# Altium schematic sheet Fuse_Block.SchDoc: <Document>
size Letter; Engineer: <Engineer>; Organization: UPEL; Address1: USU Power Electronics Lab; Address2: USTAR Building 620, RM 118; Address3: 1600 N 620 E; Address4: North Logan, UT 84341; DocumentNumber: 6; Revision: v1; SheetNumber: 6; SheetTotal: 16; ProjectName: <Project>
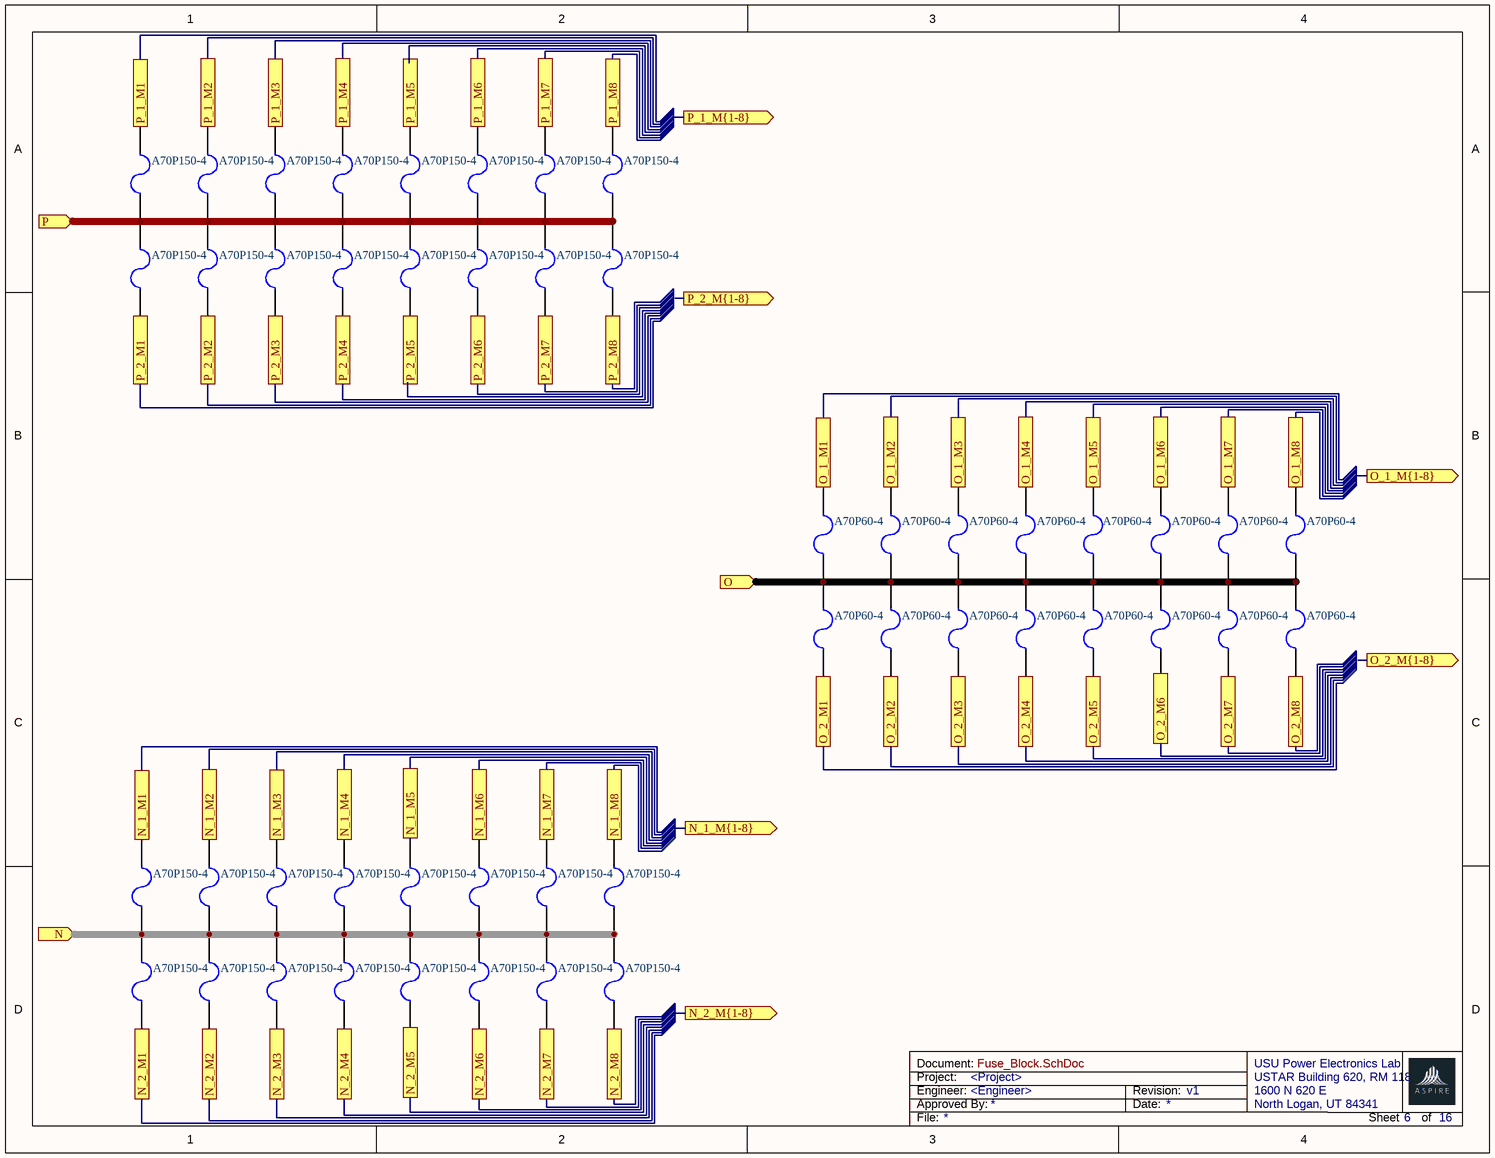
[diagram p0: Fuse_Block.SchDoc]

## Parts
F6  A70P150-4  [1206]
F17  A70P150-4  [1206]
F18  A70P150-4  [1206]
F19  A70P150-4  [1206]
F20  A70P150-4  [1206]
F21  A70P150-4  [1206]
F22  A70P150-4  [1206]
F23  A70P150-4  [1206]
F24  A70P150-4  [1206]
F25  A70P150-4  [1206]
F26  A70P150-4  [1206]
F27  A70P150-4  [1206]
F28  A70P150-4  [1206]
F29  A70P150-4  [1206]
F30  A70P150-4  [1206]
F31  A70P150-4  [1206]
F32  A70P60-4  [1206]
F33  A70P60-4  [1206]
F34  A70P60-4  [1206]
F35  A70P60-4  [1206]
F36  A70P60-4  [1206]
F37  A70P60-4  [1206]
F38  A70P60-4  [1206]
F39  A70P60-4  [1206]
F40  A70P60-4  [1206]
F41  A70P60-4  [1206]
F42  A70P60-4  [1206]
F43  A70P60-4  [1206]
F44  A70P60-4  [1206]
F45  A70P60-4  [1206]
F46  A70P60-4  [1206]
F47  A70P60-4  [1206]
F48  A70P150-4  [1206]
F49  A70P150-4  [1206]
F50  A70P150-4  [1206]
F51  A70P150-4  [1206]
F52  A70P150-4  [1206]
F53  A70P150-4  [1206]
F54  A70P150-4  [1206]
F55  A70P150-4  [1206]
F56  A70P150-4  [1206]
F57  A70P150-4  [1206]
F58  A70P150-4  [1206]
F59  A70P150-4  [1206]
F60  A70P150-4  [1206]
F61  A70P150-4  [1206]
F62  A70P150-4  [1206]
F63  A70P150-4  [1206]

## Ports
N (in), N_1_M1, N_1_M2, N_1_M3, N_1_M4, N_1_M5, N_1_M6, N_1_M7, N_1_M8, N_1_M{1-8} (out), N_2_M1, N_2_M2, N_2_M3, N_2_M4, N_2_M5, N_2_M6, N_2_M7, N_2_M8, N_2_M{1-8} (out), O (in), O_1_M1, O_1_M2, O_1_M3, O_1_M4, O_1_M5, O_1_M6, O_1_M7, O_1_M8, O_1_M{1-8} (out), O_2_M1, O_2_M2, O_2_M3, O_2_M4, O_2_M5, O_2_M6, O_2_M7, O_2_M8, O_2_M{1-8} (out), P (in), P_1_M1, P_1_M2, P_1_M3, P_1_M4, P_1_M5, P_1_M6, P_1_M7, P_1_M8, P_1_M{1-8} (out), P_2_M1, P_2_M2, P_2_M3, P_2_M4, P_2_M5, P_2_M6, P_2_M7, P_2_M8, P_2_M{1-8} (out)

## Nets
N: F48.1 F49.1 F50.1 F51.1 F52.1 F53.1 F54.1 F55.1 F56.2 F57.2 F58.2 F59.2 F60.2 F61.2 F62.2 F63.2 ; port N
N_1_M1: F48.2 ; port N_1_M1
N_1_M2: F49.2 ; port N_1_M2
N_1_M3: F50.2 ; port N_1_M3
N_1_M4: F51.2 ; port N_1_M4
N_1_M5: F52.2 ; port N_1_M5
N_1_M6: F53.2 ; port N_1_M6
N_1_M7: F54.2 ; port N_1_M7
N_1_M8: F55.2 ; port N_1_M8
N_2_M1: F56.1 ; port N_2_M1
N_2_M2: F57.1 ; port N_2_M2
N_2_M3: F58.1 ; port N_2_M3
N_2_M4: F59.1 ; port N_2_M4
N_2_M6: F61.1 ; port N_2_M6
N_2_M7: F62.1 ; port N_2_M7
N_2_M8: F63.1 ; port N_2_M8
O: F32.1 F33.1 F34.1 F35.1 F36.1 F37.1 F38.1 F39.1 F40.2 F41.2 F42.2 F43.2 F44.2 F45.2 F46.2 F47.2 ; port O
O_1_M1: F32.2 ; port O_1_M1
O_1_M2: F33.2 ; port O_1_M2
O_1_M3: F34.2 ; port O_1_M3
O_1_M4: F35.2 ; port O_1_M4
O_1_M5: F36.2 ; port O_1_M5
O_1_M6: F37.2 ; port O_1_M6
O_1_M7: F38.2 ; port O_1_M7
O_1_M8: F39.2 ; port O_1_M8
O_2_M1: F40.1 ; port O_2_M1
O_2_M2: F41.1 ; port O_2_M2
O_2_M3: F42.1 ; port O_2_M3
O_2_M4: F43.1 ; port O_2_M4
O_2_M5: F44.1 ; port O_2_M5
O_2_M7: F46.1 ; port O_2_M7
O_2_M8: F47.1 ; port O_2_M8
P: F6.1 F17.1 F18.1 F19.1 F20.1 F21.1 F22.1 F23.1 F24.2 F25.2 F26.2 F27.2 F28.2 F29.2 F30.2 F31.2 ; port P
P_1_M1: F6.2 ; port P_1_M1
P_1_M2: F17.2 ; port P_1_M2
P_1_M3: F18.2 ; port P_1_M3
P_1_M4: F19.2 ; port P_1_M4
P_1_M5: F20.2 ; port P_1_M5
P_1_M6: F21.2 ; port P_1_M6
P_1_M7: F22.2 ; port P_1_M7
P_1_M8: F23.2 ; port P_1_M8
P_2_M1: F24.1 ; port P_2_M1
P_2_M2: F25.1 ; port P_2_M2
P_2_M3: F26.1 ; port P_2_M3
P_2_M4: F27.1 ; port P_2_M4
P_2_M5: F28.1 ; port P_2_M5
P_2_M6: F29.1 ; port P_2_M6
P_2_M7: F30.1 ; port P_2_M7
P_2_M8: F31.1 ; port P_2_M8

Not connected (* = marked no-connect by the designer): F45 1; F60 1

## Notes on the sheet
- Project:
- Engineer:
- Document:
- Approved By:
- Date:
- Revision:
- File:
- Sheet
- of

## Library data of the parts
F6 F17-F63 = CMP-005-000011-1: 2 A 63 V AC 63 V DC Fuse Board Mount (Cartridge Style Excluded) Surface Mount 1206 (3216 Metric); Design Item ID: 0685T2000-01; Source: F.SchLib; Pin Count: 2; MFR Part #: 0685T2000-01; Component Type: Standard